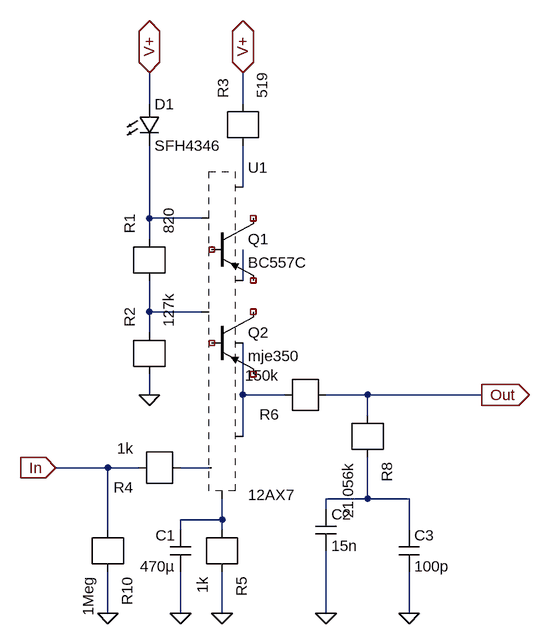
[diagram p0: schematic Draft1.asc]
Draft1.asc, the LTspice schematic file:
Version 4
SHEET 1 1460 768
WIRE 304 -224 304 -272
WIRE 448 -224 448 -272
WIRE 448 -96 448 -160
WIRE 304 -48 304 -160
WIRE 384 -48 304 -48
WIRE 304 -16 304 -48
WIRE 448 48 448 0
WIRE 304 96 304 48
WIRE 384 96 304 96
WIRE 304 128 304 96
WIRE 304 224 304 192
WIRE 448 224 448 144
WIRE 512 224 448 224
WIRE 640 224 576 224
WIRE 816 224 640 224
WIRE 640 256 640 224
WIRE 448 288 448 224
WIRE 240 336 160 336
WIRE 288 336 240 336
WIRE 400 336 352 336
WIRE 640 384 640 320
WIRE 640 384 576 384
WIRE 704 384 640 384
WIRE 576 400 576 384
WIRE 416 416 416 384
WIRE 416 416 352 416
WIRE 240 432 240 336
WIRE 352 432 352 416
WIRE 416 432 416 416
WIRE 704 432 704 384
WIRE 240 560 240 496
WIRE 352 560 352 496
WIRE 416 560 416 496
WIRE 576 560 576 464
WIRE 704 560 704 496
FLAG 160 336 In
IOPIN 160 336 In
FLAG 816 224 Out
IOPIN 816 224 Out
FLAG 304 224 0
FLAG 448 -272 V+
IOPIN 448 -272 BiDir
FLAG 304 -272 V+
IOPIN 304 -272 BiDir
FLAG 240 560 0
FLAG 416 560 0
FLAG 352 560 0
FLAG 576 560 0
FLAG 704 560 0
SYMBOL NormanKoren/12AX7 448 336 R0
SYMATTR InstName U1
SYMBOL r 304 48 R270
SYMATTR InstName R1
SYMATTR Value 820
SYMBOL r 304 192 R270
SYMATTR InstName R2
SYMATTR Value 127k
SYMBOL r 448 -160 R270
SYMATTR InstName R3
SYMATTR Value 519
SYMBOL LED 288 -224 R0
SYMATTR InstName D1
SYMATTR Value SFH4346
SYMBOL pnp 400 -48 R0
SYMATTR InstName Q1
SYMATTR Value BC557C
SYMBOL pnp 400 96 R0
SYMATTR InstName Q2
SYMATTR Value mje350
SYMBOL r 352 336 R180
SYMATTR InstName R4
SYMATTR Value 1k
SYMBOL r 416 432 R90
SYMATTR InstName R5
SYMATTR Value 1k
SYMBOL cap 368 496 R180
WINDOW 0 24 56 Left 2
WINDOW 3 24 8 Left 2
SYMATTR InstName C1
SYMATTR Value 470µ
SYMBOL r 576 224 R180
SYMATTR InstName R6
SYMATTR Value 150k
SYMBOL cap 560 400 R0
SYMATTR InstName C2
SYMATTR Value 15n
SYMBOL r 640 256 R90
SYMATTR InstName R8
SYMATTR Value 21.056k
SYMBOL cap 688 432 R0
SYMATTR InstName C3
SYMATTR Value 100p
SYMBOL r 240 432 R90
SYMATTR InstName R10
SYMATTR Value 1Meg

The netlist it stands for:
* Draft1.asc
* U1: 12AX7 (symbol NormanKoren/12AX7 not available, pin order unknown); nets seen at it: N001, N002, N003, N004, N005, N006, N008
R1 N002 N004 820
R2 N004 0 127k
R3 V+ N001 519
D1 V+ N002 SFH4346
* Q1: BC557C (symbol pnp not certain, pin order unknown); nets seen at it: 0
Q2 NC_04 NC_05 NC_06 0 mje350
R4 In N006 1k
R5 0 N008 1k
C1 0 N008 470µ
R6 N005 Out 150k
C2 N007 0 15n
R8 N007 Out 21.056k
C3 N007 0 100p
R10 0 In 1Meg
.model D D
.lib standard.dio
.model NPN NPN
.model PNP PNP
.lib standard.bjt
.backanno
.end